# EAGLE design E801 (EAGLE 7.4.0)
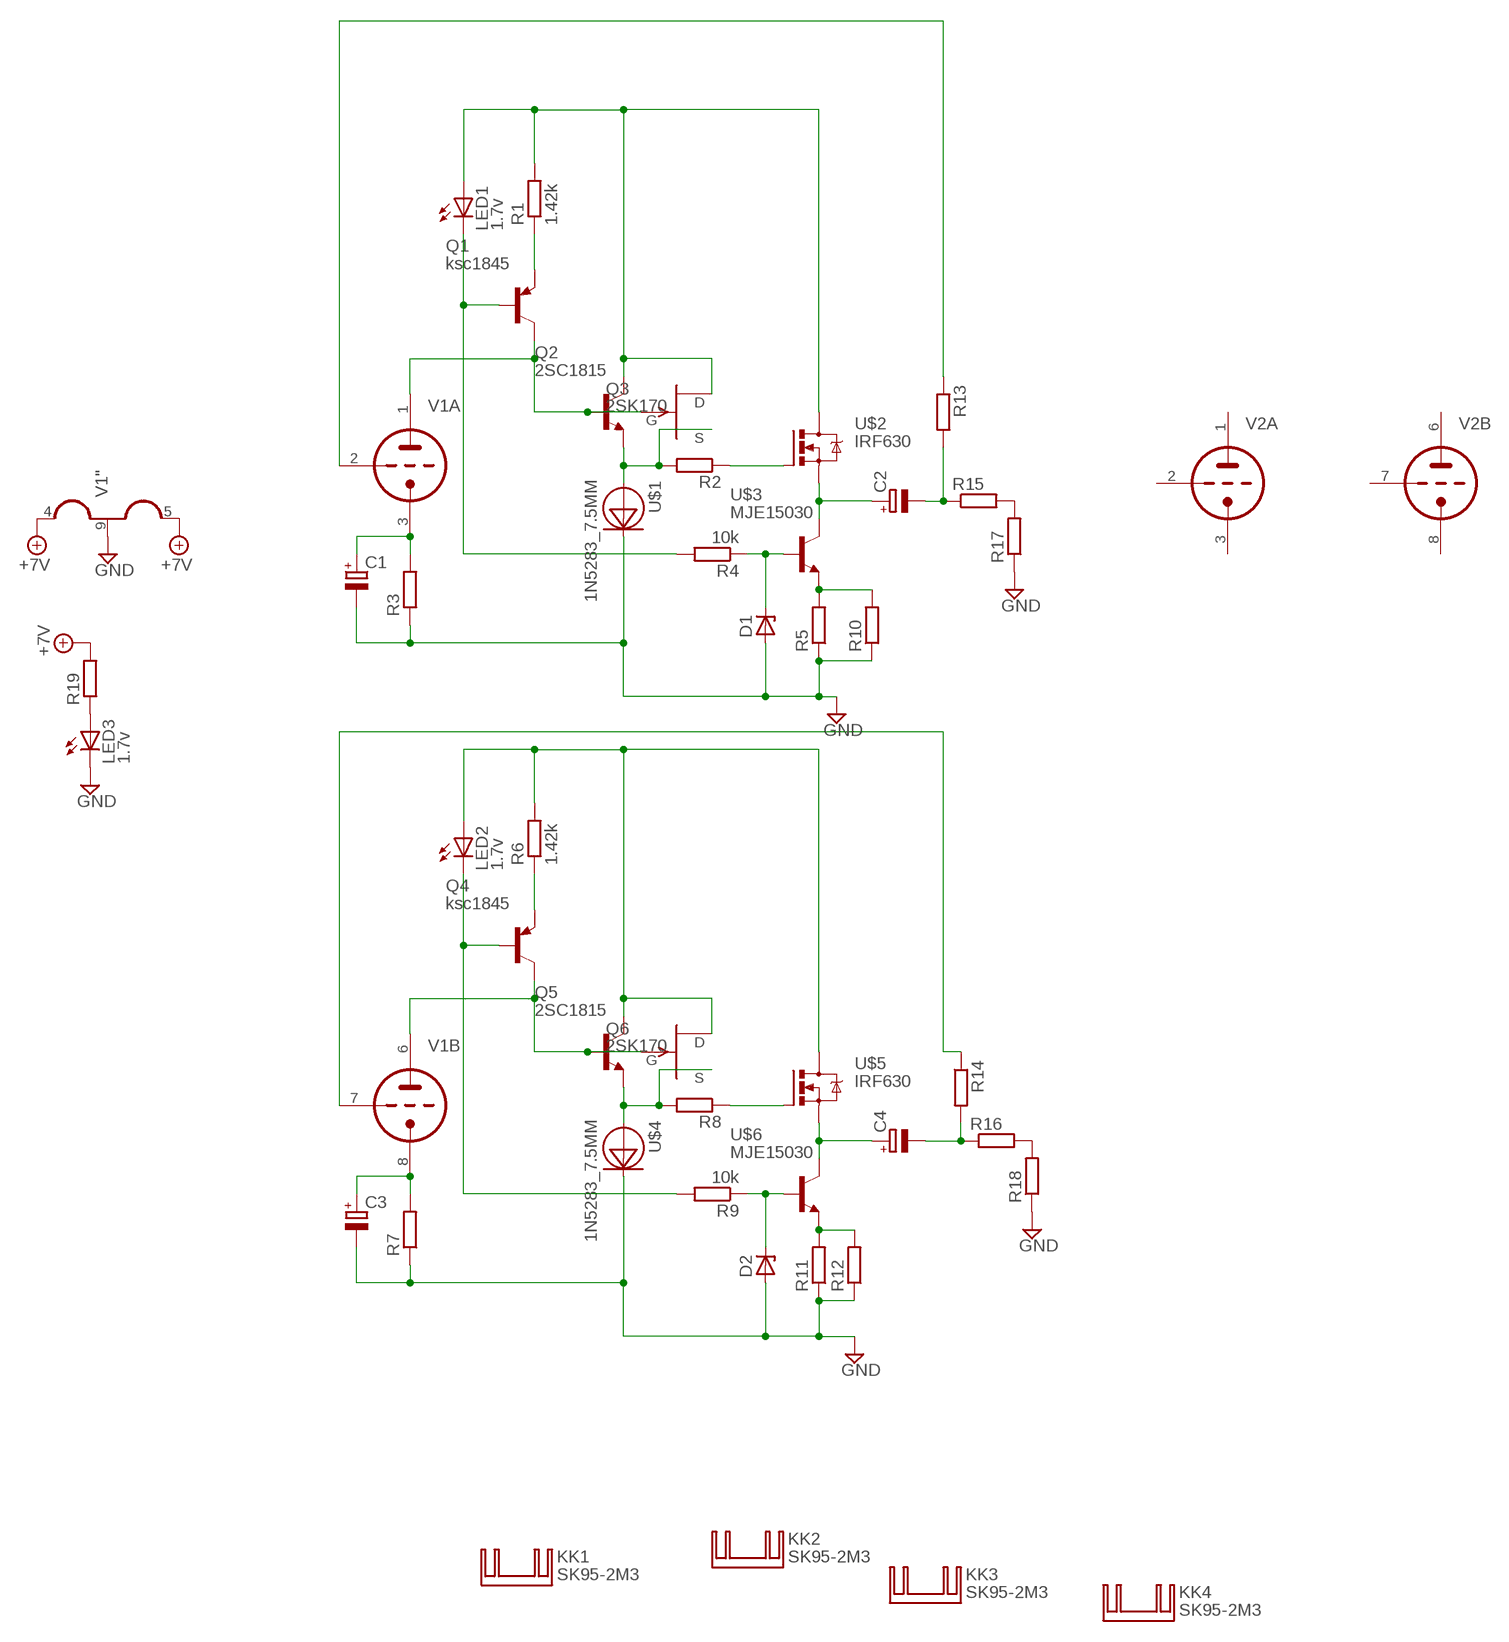
[diagram p0: schematic, sheet 1]

## Parts
C1  CPOL-EUE5-10.5  [E5-10,5]
C2  CPOL-EUE30-12AXIAL  [E30-12]
C3  CPOL-EUE5-10.5  [E5-10,5]
C4  CPOL-EUE30-12AXIAL  [E30-12]
D1  ZENER-DIODEDO34-7  [DO34Z7]
D2  ZENER-DIODEDO34-7  [DO34Z7]
KK1  SK95-2M3  [SK95-2M3]
KK2  SK95-2M3  [SK95-2M3]
KK3  SK95-2M3  [SK95-2M3]
KK4  SK95-2M3  [SK95-2M3]
LED1  1.7v  LED5MM  [LED5MM]
LED2  1.7v  LED5MM  [LED5MM]
LED3  1.7v  LED5MM  [LED5MM]
Q1  ksc1845  2SA1015  [TO92-BCE]
Q2  2SC1815  [TO92-ECB]
Q3  2SK170  [TO92-]
Q4  ksc1845  2SA1015  [TO92-BCE]
Q5  2SC1815  [TO92-ECB]
Q6  2SK170  [TO92-]
R1  1.42k  R-EU_0207/10  [0207/10]
R2  R-EU_0207/10  [0207/10]
R3  R-EU_0207/10  [0207/10]
R4  10k  R-EU_0207/10  [0207/10]
R5  R-EU_0207/10  [0207/10]
R6  1.42k  R-EU_0207/10  [0207/10]
R7  R-EU_0207/10  [0207/10]
R8  R-EU_0207/10  [0207/10]
R9  10k  R-EU_0207/10  [0207/10]
R10  R-EU_0207/10  [0207/10]
R11  R-EU_0207/10  [0207/10]
R12  R-EU_0207/10  [0207/10]
R13  R-EU_0207/10  [0207/10]
R14  R-EU_0207/10  [0207/10]
R15  R-EU_0207/10  [0207/10]
R16  R-EU_0207/10  [0207/10]
R17  R-EU_0207/10  [0207/10]
R18  R-EU_0207/10  [0207/10]
R19  R-EU_0207/10  [0207/10]
U$1  1N5283_7.5MM  [DO-35-3]
U$2  IRF630  [TO220V]
U$3  MJE15030  [TO220KG]
U$4  1N5283_7.5MM  [DO-35-3]
U$5  IRF630  [TO220V]
U$6  MJE15030  [TO220KG]
V1  12AU7-P  [NOVAL]
V2  12AU7-P  [NOVAL]

## Nets
+7V: R19.2 V1.4(":H1) V1.5(":H3)
GND: C1.- C3.- D1.A D2.A LED3.K(C) R3.1 R5.1 R7.1 R10.1 R11.1 R12.1 R17.1 R18.1 U$1.CATHODE U$4.CATHODE V1.9(":H2)
N$1: Q1.C Q2.B Q3.2(G) V1.1(A:TA)
N$2: Q1.E R1.1
N$3: LED1.K(C) Q1.B R4.2
N$4: LED1.A Q2.C Q3.1(D) R1.2 U$2.2(D)
N$5: Q2.E Q3.3(S) R2.2 U$1.ANODE
N$6: C1.+ R3.2 V1.3(A:TK)
N$7: R5.2 R10.2 U$3.3(E)
N$8: R11.2 R12.2 U$6.3(E)
N$9: C2.- R13.2 R15.1
N$10: Q4.C Q5.B Q6.2(G) V1.6(B:TA)
N$11: R2.1 U$2.1(G)
N$12: Q4.E R6.1
N$13: C2.+ U$2.3(S) U$3.2(C)
N$14: D1.C R4.1 U$3.1(B)
N$15: LED2.K(C) Q4.B R9.2
N$16: LED2.A Q5.C Q6.1(D) R6.2 U$5.2(D)
N$17: Q5.E Q6.3(S) R8.2 U$4.ANODE
N$18: C3.+ R7.2 V1.8(B:TK)
N$19: R13.1 V1.2(A:TG)
N$20: R8.1 U$5.1(G)
N$21: C4.+ U$5.3(S) U$6.2(C)
N$22: D2.C R9.1 U$6.1(B)
N$23: C4.- R14.2 R16.1
N$24: R14.1 V1.7(B:TG)
N$25: R15.2 R17.2
N$26: R16.2 R18.2
N$27: LED3.A R19.1
Unconnected: V2.1(A:TA) V2.2(A:TG) V2.3(A:TK) V2.4(":H1) V2.5(":H3) V2.6(B:TA) V2.7(B:TG) V2.8(B:TK) V2.9(":H2)

## Library data of the parts
C1-C4 = Vwvwbg:CPOL-EU: POLARIZED CAPACITOR, European symbol
D1 D2 = diode:ZENER-DIODE: Z-Diode
KK1-KK4 = heatsink:SK95-2M3: HEATSINK manufacturer Fischer/distributor Buerklin
LED1-LED3 = led:LED: LED OSRAM: - CHIPLED LG R971, LG N971, LY N971, LG Q971, LY Q971, LO R971, LY R971 LH N974, LH R974 LS Q976, LO Q976, LY Q976 LO Q996 - Hyper CHIPLED LW Q18S LB Q993, LB Q99A, LB R99A - SideLED LS A670, LO A670, LY A670, LG A670, LP A670 LB A673, LV A673, LT A673, LW A673 LH A674 LY A675 LS A676, LA A676, LO A676, LY A676, LW A676 LS A679, LY A679, LG A679 - Hyper Micro SIDELED® LS Y876, LA Y876, LO Y876, LY Y876 LT Y87S - SmartLED LW L88C, LW L88S LB L89C, LB L89S, LG L890 LS L89K, LO L89K, LY L89K LS L896, LA L896, LO L896, LY L896 - TOPLED LS T670, LO T670, LY T670, LG T670, LP T670 LSG T670, LSP T670, LSY T670, LOP T670, LYG T670 LG T671, LOG T671, LSG T671 LB T673, LV T673, LT T673, LW T673 LH T674 LS T676, LA T676, LO T676, LY T676, LB T676, LH T676, LSB T676, LW T676 LB T67C, LV T67C, LT T67C, LS T67K, LO T67K, LY T67K, LW E67C LS E67B, LA E67B, LO E67B, LY E67B, LB E67C, LV E67C, LT E67C LW T67C LS T679, LY T679, LG T679 LS T770, LO T770, LY T770, LG T770, LP T770 LB T773, LV T773, LT T773, LW T773 LH T774 LS E675, LA E675, LY E675, LS T675 LS T776, LA T776, LO T776, LY T776, LB T776 LHGB T686 LT T68C, LB T68C - Hyper Mini TOPLED® LB M676 - Mini TOPLED Santana® LG M470 LS M47K, LO M47K, LY M47K Source: http://www.osram.convergy.de LUXEON: - LUMILED® LXK2-PW12-R00, LXK2-PW12-S00, LXK2-PW14-U00, LXK2-PW14-V00 LXK2-PM12-R00, LXK2-PM12-S00, LXK2-PM14-U00 LXK2-PE12-Q00, LXK2-PE12-R00, LXK2-PE12-S00, LXK2-PE14-T00, LXK2-PE14-U00 LXK2-PB12-K00, LXK2-PB12-L00, LXK2-PB12-M00, LXK2-PB14-N00, LXK2-PB14-P00, LXK2-PB14-Q00 LXK2-PR12-L00, LXK2-PR12-M00, LXK2-PR14-Q00, LXK2-PR14-R00 LXK2-PD12-Q00, LXK2-PD12-R00, LXK2-PD12-S00 LXK2-PH12-R00, LXK2-PH12-S00 LXK2-PL12-P00, LXK2-PL12-Q00, LXK2-PL12-R00 Source: www.luxeon.com KINGBRIGHT: KA-3528ASYC Source: www.kingbright.com
Q1 Q4 = tranzistory PNP:2SA1015: PNP Transistor
Q2 Q5 = transistor:2SC1815: NPN EPITAXIAL TRANSISTOR Source: TOSHIBA .. 2SC1815 1.pdf
Q3 Q6 = tranzistory FET:2SK170: N-Channel Junction FET
R1-R19 = Vwvwbg:R-EU_: RESISTOR, European symbol
U$1 U$4 = crd:1N5283: 0.22 mA through 4.23 mA current regulating diode series
U$2 U$5 = Vwvwbg:IRF630
U$3 U$6 = transistor:MJE15030
V1 V2 = tubes:12AU7-P

## Board
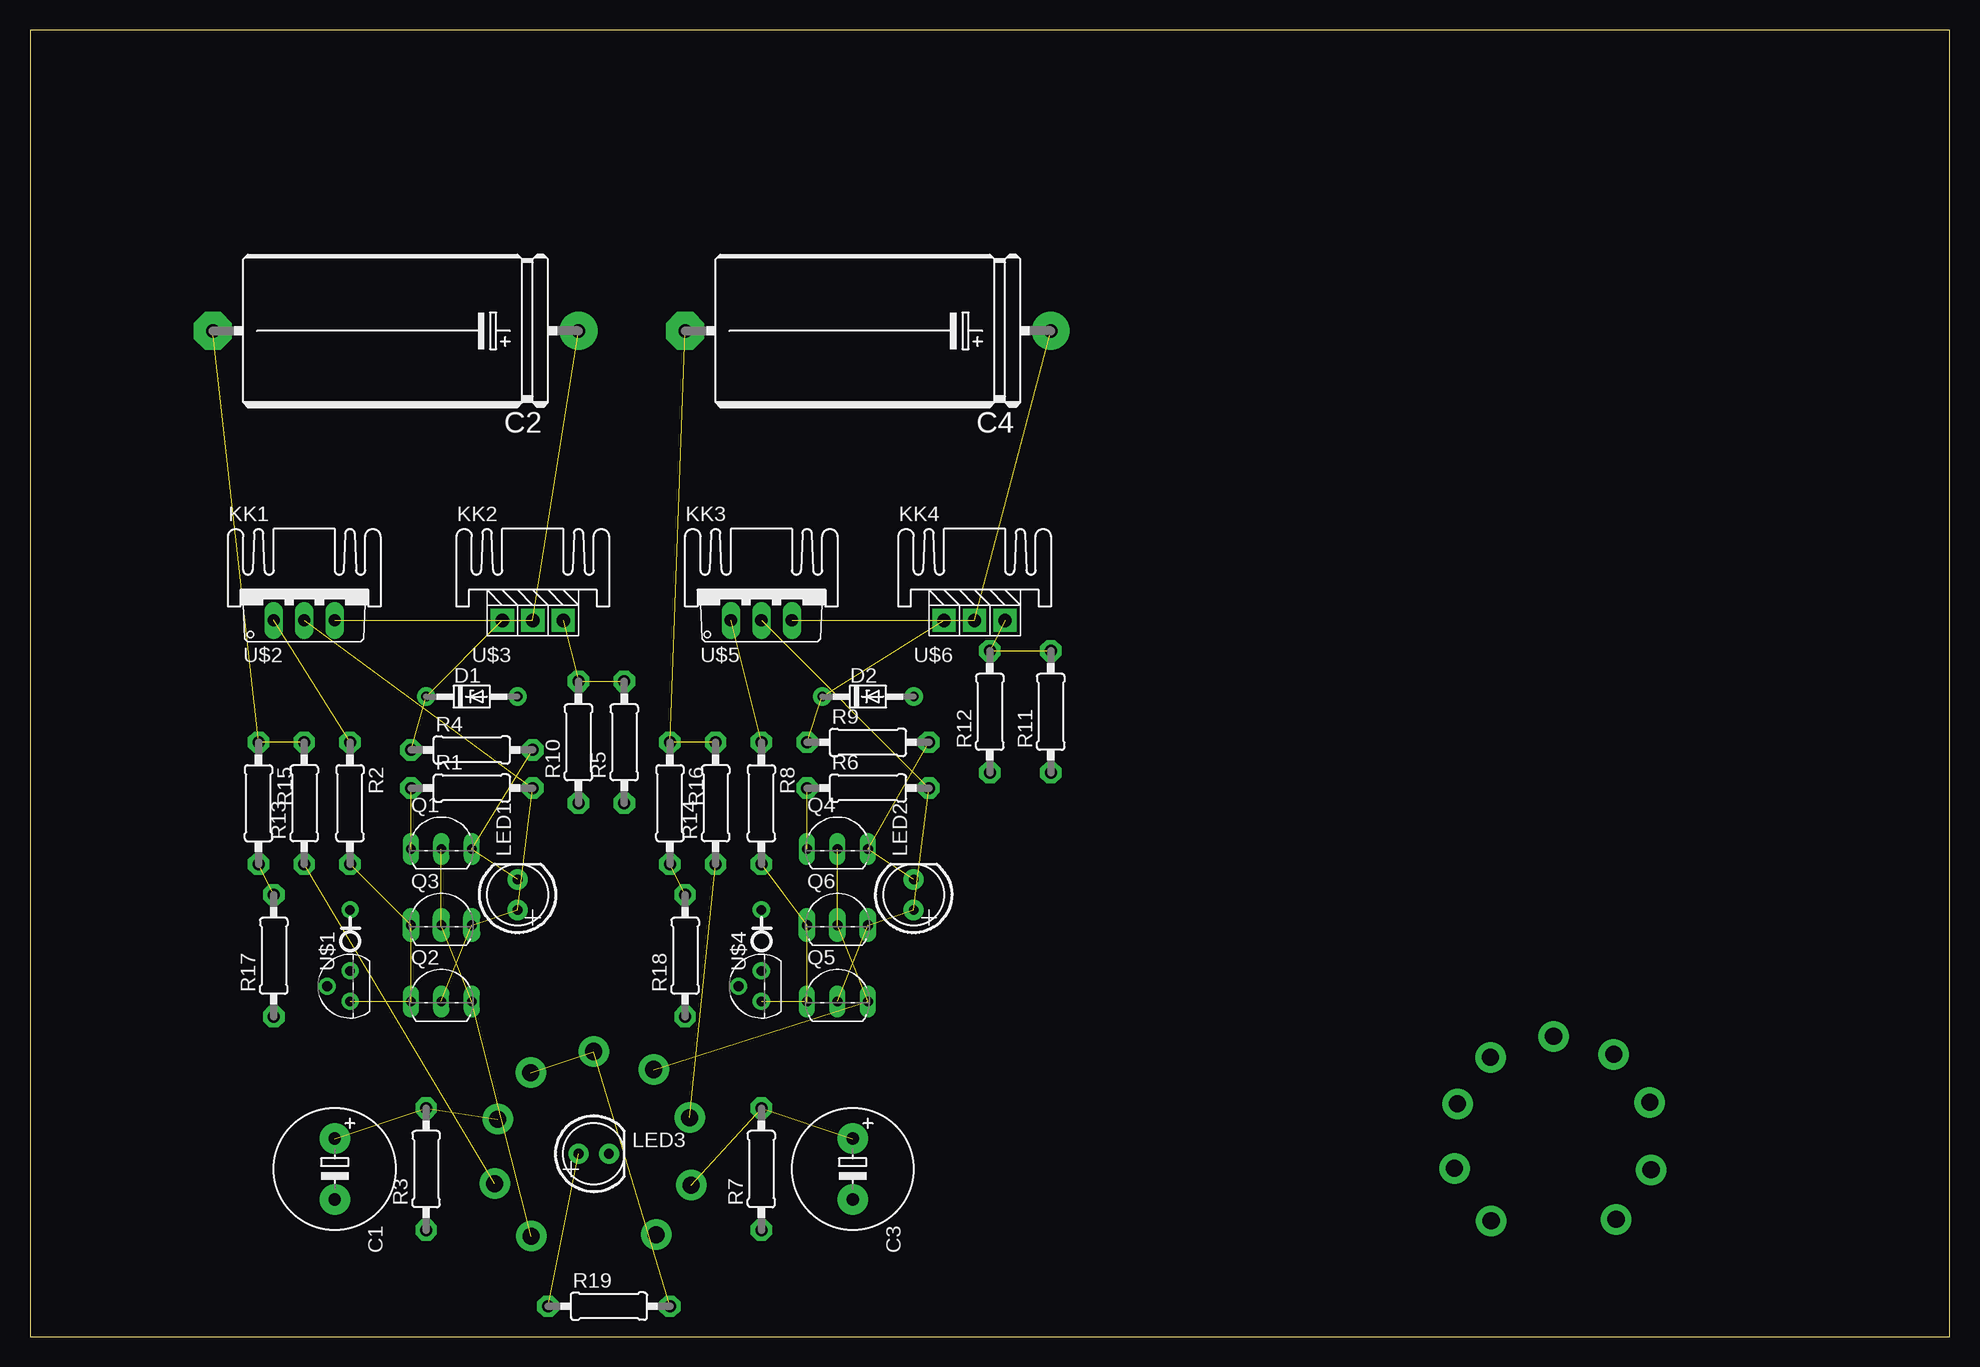
[diagram p1: board, top side]
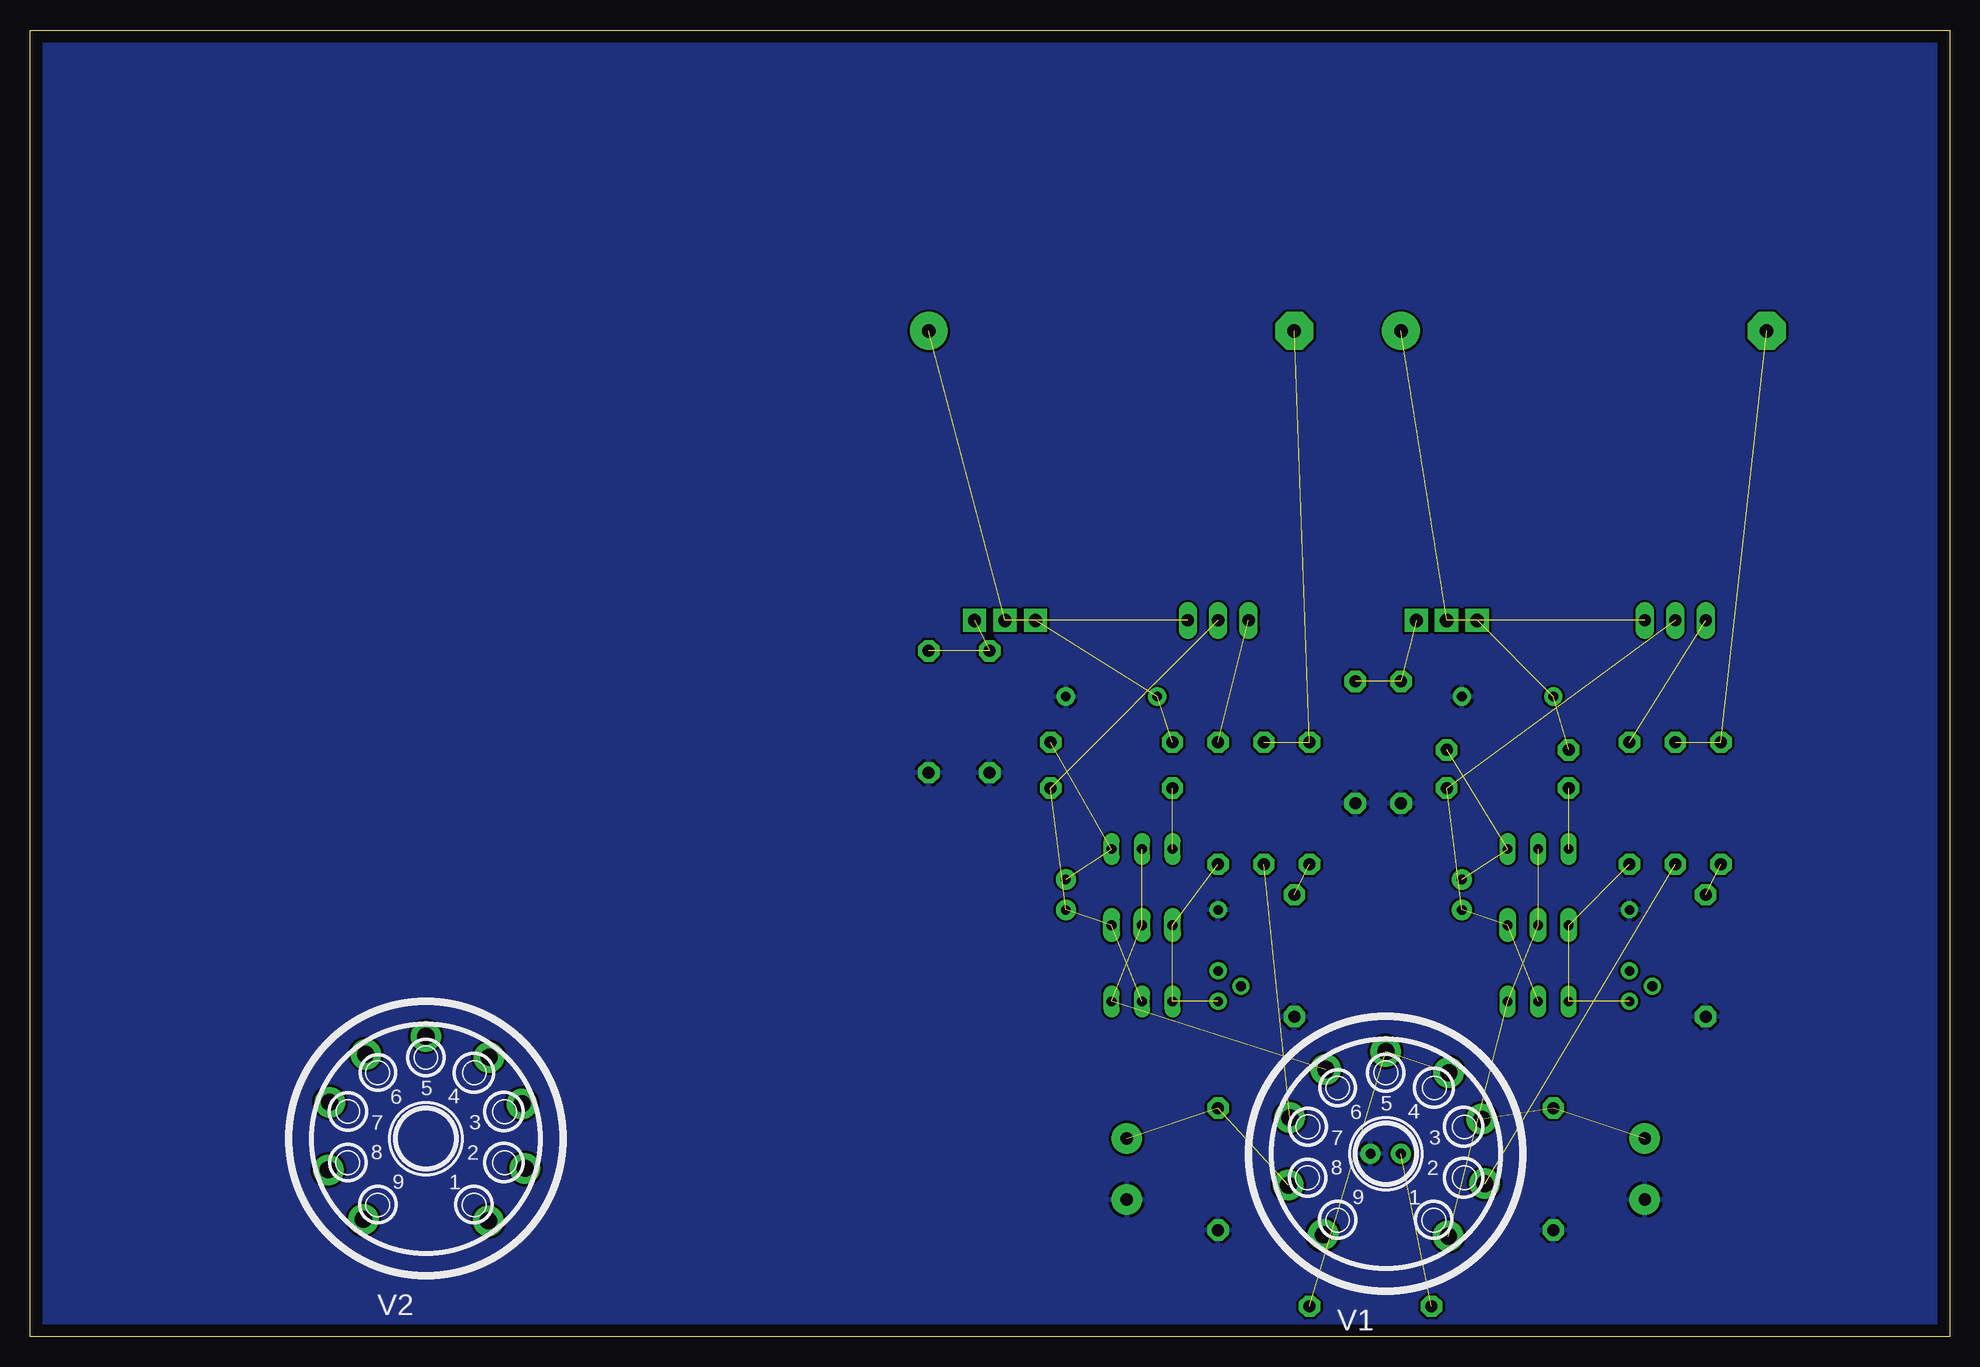
[diagram p2: board, bottom side, seen from below]

Size 160 x 108.89 mm. Coordinates in mm from the lower left corner, seen from the top.
Outline: 0,0 160,0 160,108.89 0,108.89 0,0
Copper layers (1*16): Top 0.035mm / dielectric 1.5mm / Bottom 0.035mm
Design rules "default": minimum track width 10mil, minimum drill 24mil, track to track 8mil, track to pad 8mil, pad to pad 8mil, via to via 8mil, smd to smd 8mil, copper to edge 40mil, drill to drill 8mil, minimum pad ring 10mil, minimum via ring 8mil, stop-mask expansion 4mil, vias tented up to drill 0mil, thermal gap 10mil

### Footprints (pad centres in the part's own frame; a part is rotated, then mirrored left to right if it is on the bottom)
E5-10,5 = drill 1.016 pad 2.54: + -2.54,0; - 2.54,0
E30-12 = drill 1.118 pad 3.15: + -15.24,0 | drill 1.118 pad 3.15 octagon: - 15.24,0
DO34Z7 = drill 0.813 pad 1.524: A 3.81,0; C -3.81,0
LED5MM = drill 0.813 pad 1.676: A -1.27,0; K 1.27,0
TO92-BCE = drill 0.813 long: B 2.54,0; C 0,0; E -2.54,0
TO92-ECB = drill 0.813 long: B 2.54,0; C 0,0; E -2.54,0
TO92- = drill 0.813 pad 1.422 long: 1 2.54,0; 2 0,0; 3 -2.54,0
0207/10 = drill 1 pad 1.778 octagon: 1 -5.08,0; 2 5.08,0
DO-35-3 = drill 0.813 pad 1.422: 1 -1.27,0; 2 -2.54,1.905; ANODE -3.81,0; CATHODE 3.81,0
TO220V = drill 1.016 long: 1 -2.54,-2.54; 2 0,-2.54; 3 2.54,-2.54
TO220KG = drill 1.1 pad 1.93 square: 1 -2.54,0; 2 0,0; 3 2.54,0
NOVAL = drill 1.422 pad 2.54: 1 5.207,-6.858; 2 8.254,-2.484; 3 8.004,2.893; 4 5.258,6.77; 5 0,8.524; 6 -5.004,7.024; 7 -8.004,3.02; 8 -8.127,-2.611; 9 -5.207,-6.731

### Placement (x,y rotation side)
C1  25.4,13.97 270 top
C2  30.48,83.82 180 top
C3  68.58,13.97 270 top
C4  69.85,83.82 180 top
D1  36.83,53.34 0 top
D2  69.85,53.34 0 top
KK1  22.86,62.23 0 top
KK2  41.91,62.23 0 top
KK3  60.96,62.23 0 top
KK4  78.74,62.23 0 top
LED1  40.64,36.83 90 top
LED2  73.66,36.83 90 top
LED3  46.99,15.24 0 top
Q1  34.29,40.64 0 top
Q2  34.29,27.94 0 top
Q3  34.29,34.29 0 top
Q4  67.31,40.64 0 top
Q5  67.31,27.94 0 top
Q6  67.31,34.29 0 top
R1  36.83,45.72 0 top
R2  26.67,44.45 270 top
R3  33.02,13.97 90 top
R4  36.83,48.9 0 top
R5  49.53,49.53 90 top
R6  69.85,45.72 0 top
R7  60.96,13.97 90 top
R8  60.96,44.45 270 top
R9  69.85,49.53 0 top
R10  45.72,49.53 90 top
R11  85.09,52.07 90 top
R12  80.01,52.07 90 top
R13  22.86,44.45 90 top
R14  57.15,44.45 90 top
R15  19.05,44.45 270 top
R16  53.34,44.45 270 top
R17  20.32,31.75 90 top
R18  54.61,31.75 90 top
R19  48.26,2.54 0 top
U$1  26.67,31.75 90 top
U$2  22.86,62.23 0 top
U$3  41.91,59.69 0 top
U$4  60.96,31.75 90 top
U$5  60.96,62.23 0 top
U$6  78.74,59.69 0 top
V1  46.99,15.24 0 bottom
V2  127,16.51 0 bottom

### Tracks (layer width: path | path; a pad name or v marks a point on that pad's centre or on a via)
+7V  (2 unrouted)
GND
  pour Bottom: 0,107.95 0,0 160.02,0 160.02,107.95
N$1  (3 unrouted)
N$2  (1 unrouted)
N$3  (2 unrouted)
N$4  (4 unrouted)
N$5  (3 unrouted)
N$6  (2 unrouted)
N$7  (2 unrouted)
N$8  (2 unrouted)
N$9  (2 unrouted)
N$10  (3 unrouted)
N$11  (1 unrouted)
N$12  (1 unrouted)
N$13  (2 unrouted)
N$14  (2 unrouted)
N$15  (2 unrouted)
N$16  (4 unrouted)
N$17  (3 unrouted)
N$18  (2 unrouted)
N$19  (1 unrouted)
N$20  (1 unrouted)
N$21  (2 unrouted)
N$22  (2 unrouted)
N$23  (2 unrouted)
N$24  (1 unrouted)
N$25  (1 unrouted)
N$26  (1 unrouted)
N$27  (1 unrouted)